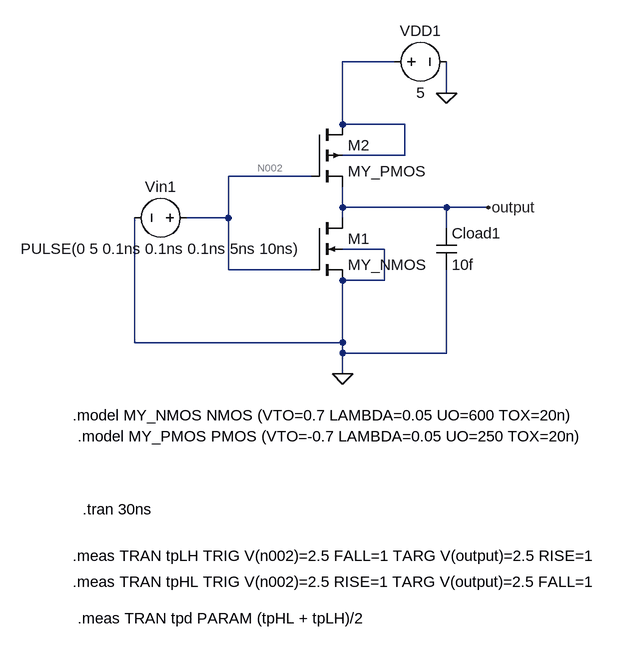
[diagram p0: schematic propagation_delay.asc]
propagation_delay.asc, the LTspice schematic file:
Version 4.1
SHEET 1 880 680
WIRE 288 -288 208 -288
WIRE 368 -240 368 -288
WIRE 208 -192 208 -288
WIRE 304 -192 208 -192
WIRE 304 -144 304 -192
WIRE 304 -144 208 -144
WIRE 160 -112 32 -112
WIRE 208 -64 208 -96
WIRE 368 -64 208 -64
WIRE 432 -64 368 -64
WIRE 32 -48 32 -112
WIRE 32 -48 -32 -48
WIRE 208 -48 208 -64
WIRE 368 -32 368 -64
WIRE 272 0 208 0
WIRE 32 32 32 -48
WIRE 160 32 32 32
WIRE 272 48 272 0
WIRE 272 48 208 48
WIRE -112 144 -112 -48
WIRE 208 144 208 48
WIRE 208 144 -112 144
WIRE 208 160 208 144
WIRE 368 160 368 32
WIRE 368 160 208 160
WIRE 208 192 208 160
FLAG 208 192 0
FLAG 368 -240 0
FLAG 432 -64 output
SYMBOL nmos4 160 -48 R0
SYMATTR InstName M1
SYMATTR Value MY_NMOS
SYMATTR Value2 l=1u w=1u
SYMBOL voltage -16 -48 R90
WINDOW 0 -32 56 VBottom 2
WINDOW 3 32 56 VTop 2
WINDOW 123 0 0 Left 0
WINDOW 39 0 0 Left 0
SYMATTR InstName Vin1
SYMATTR Value PULSE(0 5 0.1ns 0.1ns 0.1ns 5ns 10ns)
SYMBOL voltage 272 -288 R270
WINDOW 0 32 56 VTop 2
WINDOW 3 -32 56 VBottom 2
WINDOW 123 0 0 Left 0
WINDOW 39 0 0 Left 0
SYMATTR InstName VDD1
SYMATTR Value 5
SYMBOL cap 352 -32 R0
SYMATTR InstName Cload1
SYMATTR Value 10f
SYMBOL pmos4 160 -192 R0
SYMATTR InstName M2
SYMATTR Value MY_PMOS
SYMATTR Value2 l=1u w=2.4u
TEXT -208 256 Left 2 !.model MY_NMOS NMOS (VTO=0.7 LAMBDA=0.05 UO=600 TOX=20n)
TEXT -200 288 Left 2 !.model MY_PMOS PMOS (VTO=-0.7 LAMBDA=0.05 UO=250 TOX=20n)
TEXT -192 400 Left 2 !.tran 30ns
TEXT -208 472 Left 2 !.meas TRAN tpLH TRIG V(n002)=2.5 FALL=1 TARG V(output)=2.5 RISE=1
TEXT -208 512 Left 2 !.meas TRAN tpHL TRIG V(n002)=2.5 RISE=1 TARG V(output)=2.5 FALL=1
TEXT -200 568 Left 2 !.meas TRAN tpd PARAM (tpHL + tpLH)/2

The netlist it stands for:
* propagation_delay.asc
M1 output N002 0 0 MY_NMOS l=1u w=1u
Vin1 N002 0 PULSE(0 5 0.1ns 0.1ns 0.1ns 5ns 10ns)
VDD1 N001 0 5
Cload1 output 0 10f
M2 N001 N002 output N001 MY_PMOS l=1u w=2.4u
.model NMOS NMOS
.model PMOS PMOS
.lib standard.mos
.model MY_NMOS NMOS (VTO=0.7 LAMBDA=0.05 UO=600 TOX=20n)
.model MY_PMOS PMOS (VTO=-0.7 LAMBDA=0.05 UO=250 TOX=20n)
.tran 30ns
.meas TRAN tpLH TRIG V(n002)=2.5 FALL=1 TARG V(output)=2.5 RISE=1
.meas TRAN tpHL TRIG V(n002)=2.5 RISE=1 TARG V(output)=2.5 FALL=1
.meas TRAN tpd PARAM (tpHL + tpLH)/2
.backanno
.end